# EAGLE design shield (EAGLE 7.6.0)
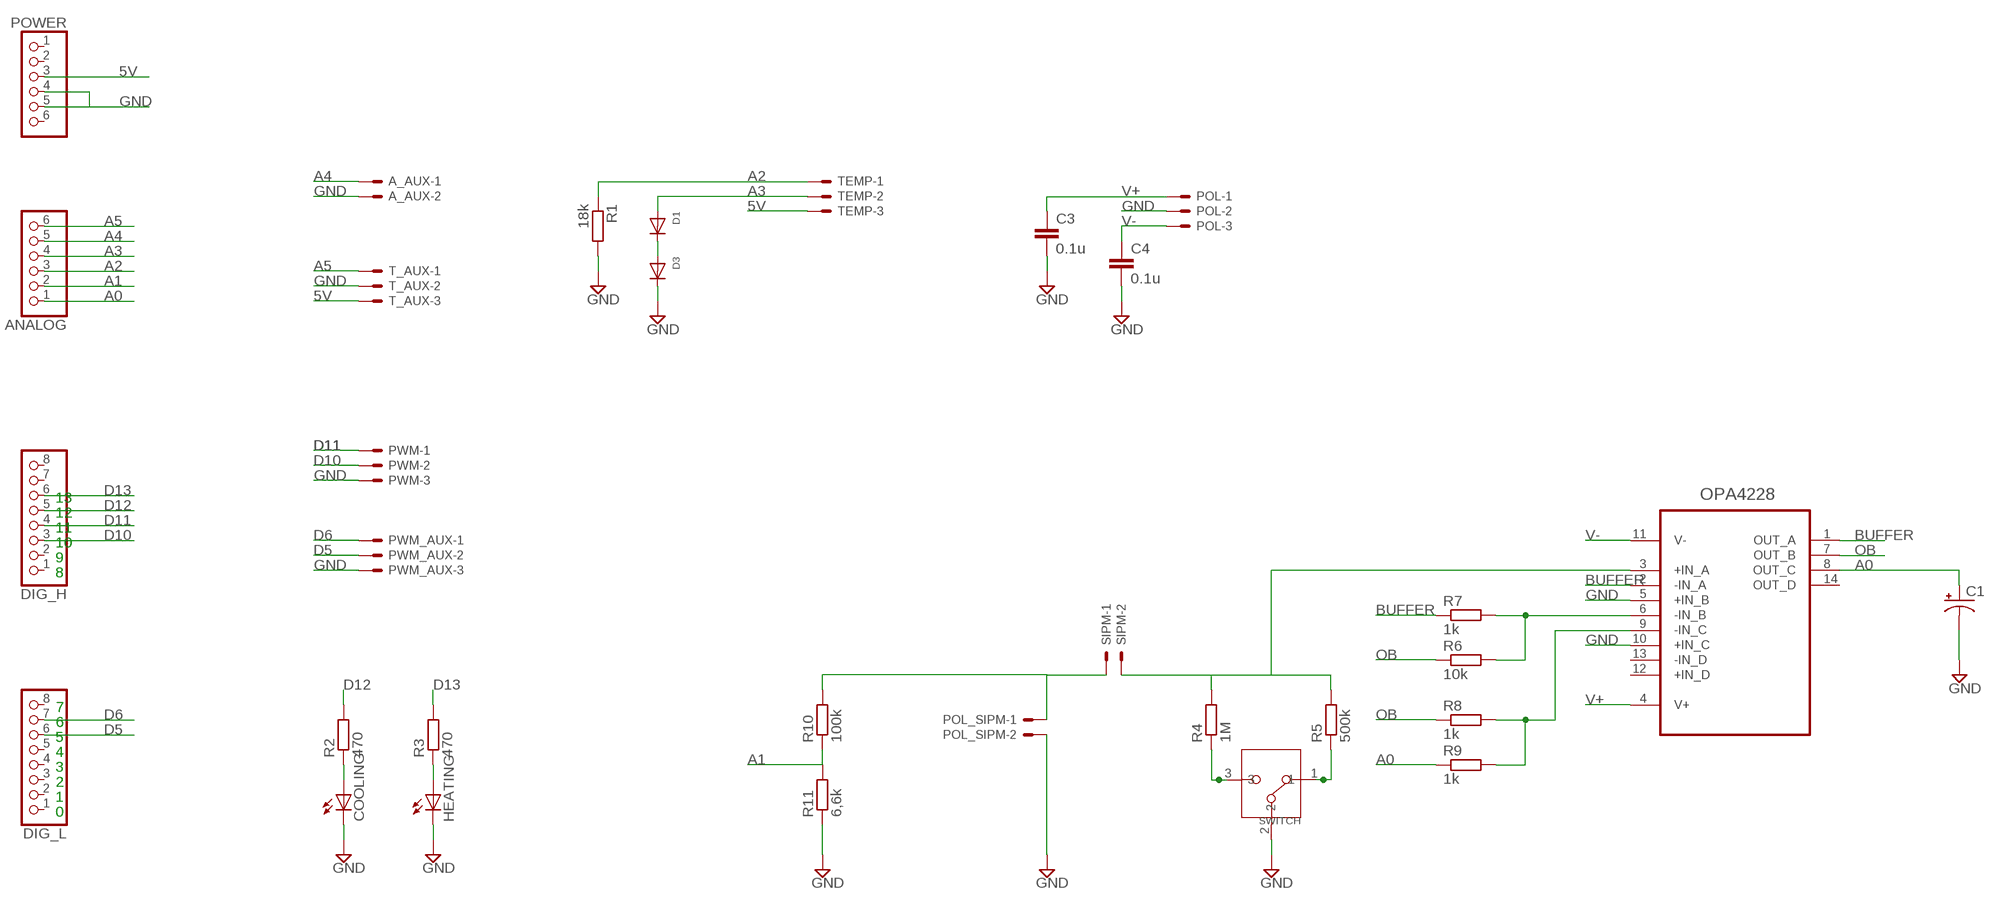
[diagram p0: schematic, sheet 1]

## Parts
A_AUX  22-23-2021  [22-23-2021]
ANALOG  PINHD-1X6  [1X06]
C1  CPOL-USSMCC  [SMC_C]
C3  0.1u  C-EUC0805K  [C0805K]
C4  0.1u  C-EUC0805K  [C0805K]
COOLING  LEDSMT1206  [1206]
D1  DIODEDO-1N4148  [DO-1N4148]
D3  DIODEDO-1N4148  [DO-1N4148]
DIG_H  PINHD-1X8  [1X08]
DIG_L  PINHD-1X8  [1X08]
HEATING  LEDSMT1206  [1206]
OPA4228  OPA4228UA  [SOIC127P600X175-14N]
POL  22-23-2031  [22-23-2031]
POL_SIPM  22-23-2021  [22-23-2021]
POWER  PINHD-1X6  [1X06]
PWM  22-23-2031  [22-23-2031]
PWM_AUX  22-23-2031  [22-23-2031]
R1  18k  R-EU_0309/12  [0309/12]
R2  470  R-EU_R0805W  [R0805W]
R3  470  R-EU_R0805W  [R0805W]
R4  1M  R-EU_R0805W  [R0805W]
R5  500k  R-EU_R0805W  [R0805W]
R6  10k  R-EU_R0805W  [R0805W]
R7  1k  R-EU_R0805W  [R0805W]
R8  1k  R-EU_R0805W  [R0805W]
R9  1k  R-EU_R0805W  [R0805W]
R10  100k  R-EU_R0805W  [R0805W]
R11  6,6k  R-EU_R0805W  [R0805W]
SIPM  22-23-2021  [22-23-2021]
SWITCH  DIP-SLIDE-SWITCH(3P-11.6X4.0X5.4+2.0MM)-EG1218  [SW3-2.5-11.6X4.0X5.4+2.0MM]
T_AUX  22-23-2031  [22-23-2031]
TEMP  22-23-2031  [22-23-2031]

## Nets
5V: POWER.3 T_AUX.3 TEMP.3
A0: ANALOG.1 C1.+ OPA4228.8(OUT_C) R9.1
A1: ANALOG.2 R10.1 R11.2
A2: ANALOG.3 R1.1 TEMP.1
A3: ANALOG.4 D1.A TEMP.2
A4: A_AUX.1 ANALOG.5
A5: ANALOG.6 T_AUX.1
BUFFER: OPA4228.1(OUT_A) OPA4228.2(-IN_A) R7.1
D5: DIG_L.6 PWM_AUX.2
D6: DIG_L.7 PWM_AUX.1
D10: DIG_H.3 PWM.2
D11: DIG_H.4 PWM.1
D12: DIG_H.5 R2.2
D13: DIG_H.6 R3.2
GND: A_AUX.2 C1.- C3.2 C4.2 COOLING.C D3.C HEATING.C OPA4228.5(+IN_B) OPA4228.10(+IN_C) POL.2 POL_SIPM.2 POWER.4 POWER.5 PWM.3 PWM_AUX.3 R1.2 R11.1 SWITCH.2 T_AUX.2
N$1: COOLING.A R2.1
N$2: HEATING.A R3.1
N$3: OPA4228.6(-IN_B) R6.2 R7.2
N$4: POL_SIPM.1 R10.2 SIPM.1
N$7: R4.1 SWITCH.3
N$8: R5.1 SWITCH.1
N$9: OPA4228.3(+IN_A) R4.2 R5.2 SIPM.2
N$12: OPA4228.9(-IN_C) R8.2 R9.2
N$16: D1.C D3.A
OB: OPA4228.7(OUT_B) R6.1 R8.1
V+: C3.1 OPA4228.4(V+) POL.1
V-: C4.1 OPA4228.11(V-) POL.3
Unconnected: DIG_H.1 DIG_H.2 DIG_H.7 DIG_H.8 DIG_L.1 DIG_L.2 DIG_L.3 DIG_L.4 DIG_L.5 DIG_L.8 OPA4228.12(+IN_D) OPA4228.13(-IN_D) OPA4228.14(OUT_D) POWER.1 POWER.2 POWER.6

## Notes on the sheet
- 13
- 12
- 11
- 10
- 9
- 8
- 7
- 6
- 5
- 4
- 3
- 2
- 1
- 0

## Library data of the parts
A_AUX POL_SIPM SIPM = con-molex:22-23-2021: .100" (2.54mm) Center Header - 2 Pin; MF: MOLEX; MPN: 22-23-2021; OC_FARNELL: 1462926; OC_NEWARK: 25C3832
ANALOG POWER = pinhead:PINHD-1X6: PIN HEADER
C1 = rcl:CPOL-US: POLARIZED CAPACITOR, American symbol
C3 C4 = resistor:C-EU: CAPACITOR, European symbol
COOLING HEATING = adafruit:LED: LED OSRAM: - CHIPLED LG R971, LG N971, LY N971, LG Q971, LY Q971, LO R971, LY R971 LH N974, LH R974 LS Q976, LO Q976, LY Q976 LO Q996 - Hyper CHIPLED LW Q18S LB Q993, LB Q99A, LB R99A - SideLED LS A670, LO A670, LY A670, LG A670, LP A670 LB A673, LV A673, LT A673, LW A673 LH A674 LY A675 LS A676, LA A676, LO A676, LY A676, LW A676 LS A679, LY A679, LG A679 - Hyper Micro SIDELED® LS Y876, LA Y876, LO Y876, LY Y876 LT Y87S - SmartLED LW L88C, LW L88S LB L89C, LB L89S, LG L890 LS L89K, LO L89K, LY L89K LS L896, LA L896, LO L896, LY L896 - TOPLED LS T670, LO T670, LY T670, LG T670, LP T670 LSG T670, LSP T670, LSY T670, LOP T670, LYG T670 LG T671, LOG T671, LSG T671 LB T673, LV T673, LT T673, LW T673 LH T674 LS T676, LA T676, LO T676, LY T676, LB T676, LH T676, LSB T676, LW T676 LB T67C, LV T67C, LT T67C, LS T67K, LO T67K, LY T67K, LW E67C LS E67B, LA E67B, LO E67B, LY E67B, LB E67C, LV E67C, LT E67C LW T67C LS T679, LY T679, LG T679 LS T770, LO T770, LY T770, LG T770, LP T770 LB T773, LV T773, LT T773, LW T773 LH T774 LS E675, LA E675, LY E675, LS T675 LS T776, LA T776, LO T776, LY T776, LB T776 LHGB T686 LT T68C, LB T68C - Hyper Mini TOPLED® LB M676 - Mini TOPLED Santana® LG M470 LS M47K, LO M47K, LY M47K Source: http://www.osram.convergy.de/
D1 D3 = adafruit:DIODE: Diode SMADIODE - SMA Surface Mount Package 20V 1A Schottky Diode Digikey: 641-1014-6-ND DO-1N4148 - Through Hole Small Current Diode SOD-123 20V 1 A (.5mV Vf) Schottky Diode - Digikey: MBRX120TPMSCT-ND SOD-323 10V 570mA (.38mV Vf, 3ns) Schottky Diode - Digikey: ZLLS410CT-ND SOD-523 30V 30mA Schottky Diode (RB751S-40TE61) - Digikey: RB751S-40TE61CT-ND SOT23-R/W - SOT23 Package (R = Solder Paste/Reflow Ovens, W = Hand-Soldering) BAT54Film 40V 300mA - Digikey: 497-7162-1-ND
DIG_H DIG_L = pinhead:PINHD-1X8: PIN HEADER
OPA4228 = OPA4228UA:OPA4228UA: OPERATIONAL AMPLIFIERS; DESCRIPTION: High Precision, Low Noise Operational Amplifiers 14-SOIC -55 to 125; DIGI-KEY_PART_NUMBER: OPA4228UA-ND; DIGI-KEY_PURCHASE_URL: https://www.digikey.com/product-detail/en/texas-instruments/OPA4228UA/OPA4228UA-ND/295581?utm_source=snapeda&utm_medium=aggregator&utm_campaign=symbol; MF: Texas Instruments; MP: OPA4228UA; PACKAGE: SOIC-14 Texas Instruments
POL PWM PWM_AUX T_AUX TEMP = con-molex:22-23-2031: .100" (2.54mm) Center Header - 3 Pin; MF: MOLEX; MPN: 22-23-2031; OC_FARNELL: 1462950; OC_NEWARK: 30C0862
R1 = rcl:R-EU_: RESISTOR, European symbol
R2-R11 = resistor:R-EU_: RESISTOR, European symbol
SWITCH = SWITCH_SPDT:DIP-SLIDE-SWITCH(3P-11.6X4.0X5.4+2.0MM): 311010006; AVAILABILITY: Good; DESCRIPTION: EG Series SPDT On-On Vertical Through Hole Slide Switch; MF: E-Switch; MP: EG1218; PACKAGE: FakePackage u; PRICE: 0.40 USD

## Net classes
0 default: width 0.152 mm, drill 0.305 mm, clearance 0.152 mm

## Board
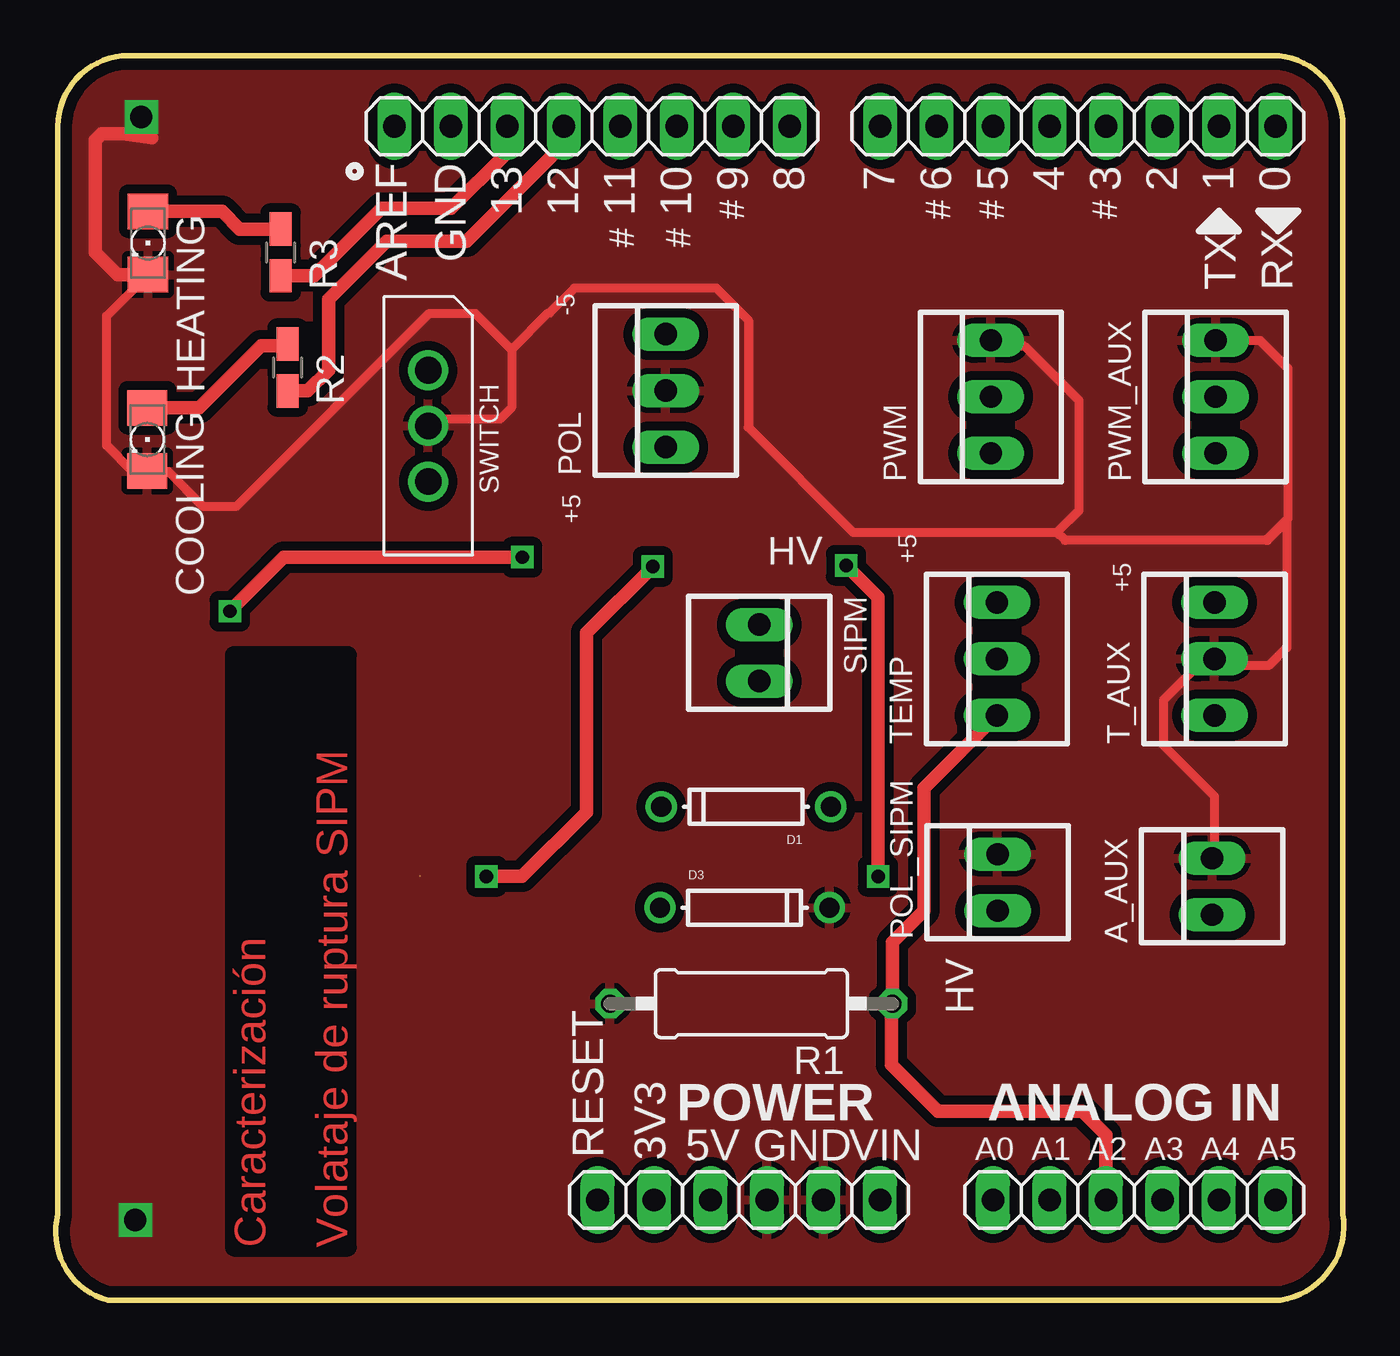
[diagram p1: board, top side]
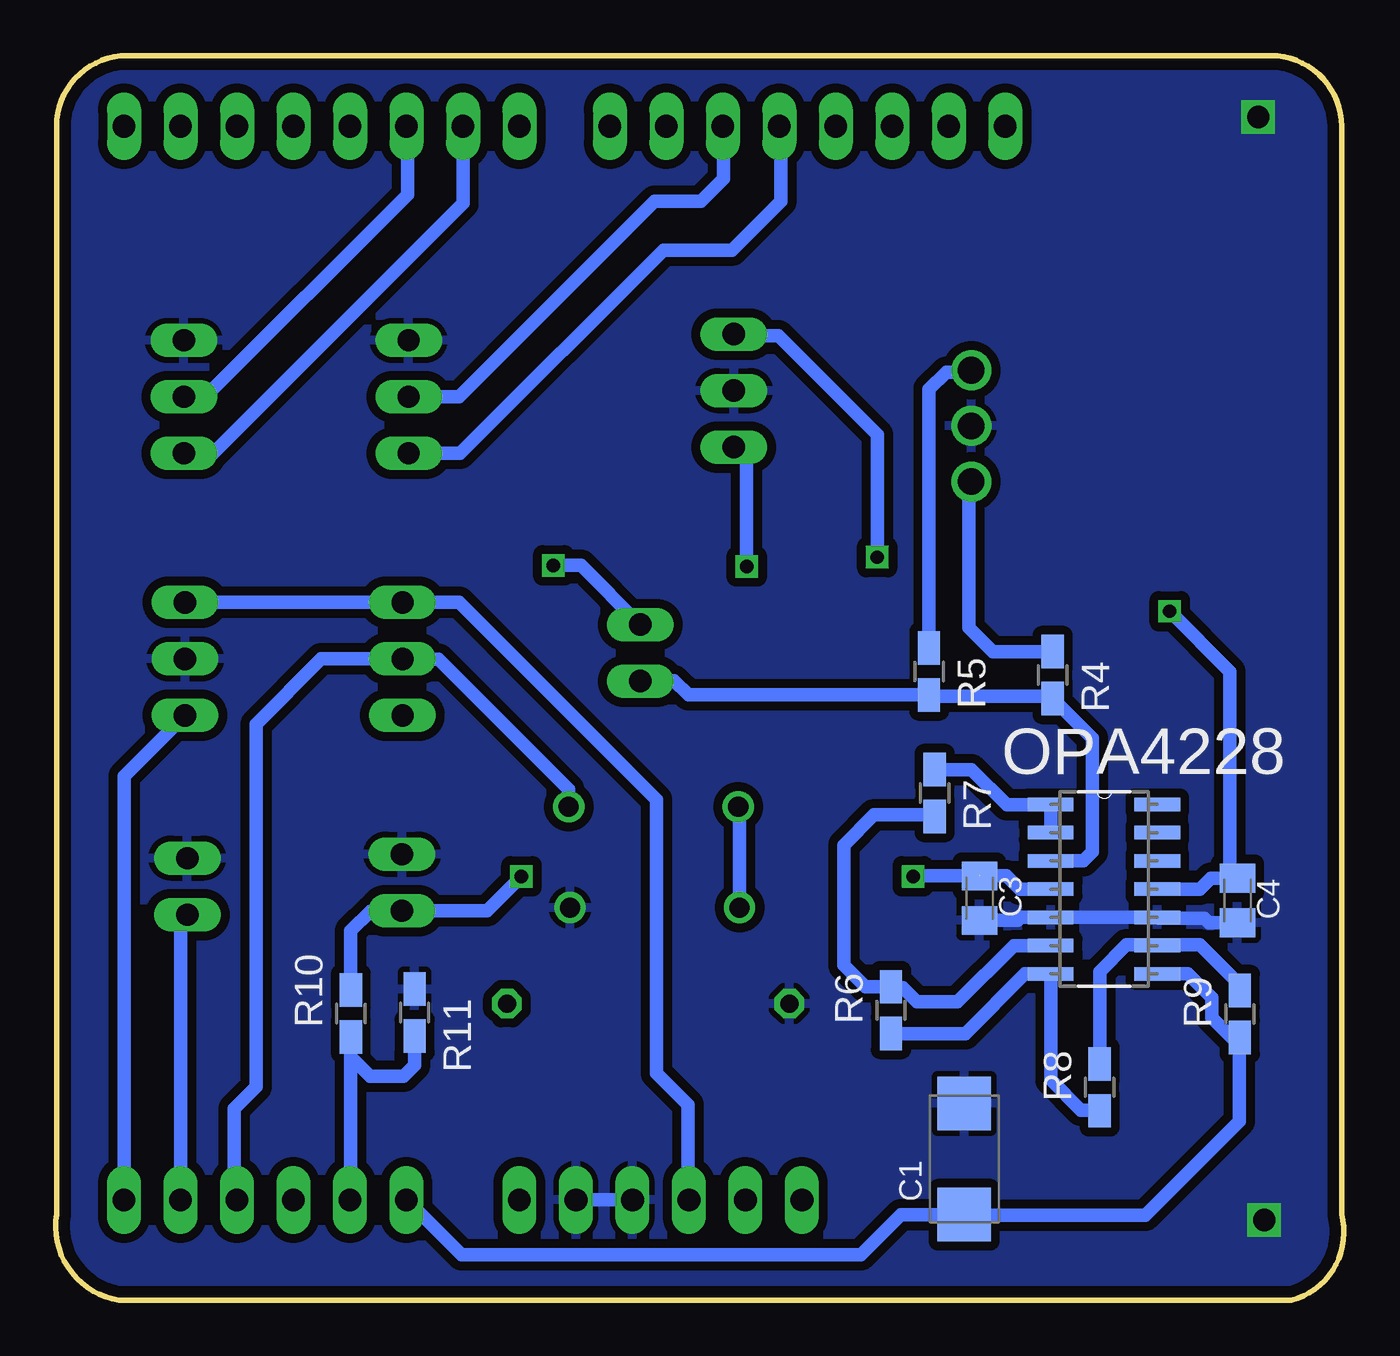
[diagram p2: board, bottom side, seen from below]

Size 57.93 x 55.95 mm. Coordinates in mm from the lower left corner, seen from the top.
Outline: 3.28,55.95 54.71,55.95 arc-90 57.89,52.77 57.89,3.88 arc-90 55.07,0 2.36,0 arc-90 0.1,3.88 0.1,52.77 arc-90 3.28,55.95
Copper layers (1*16): Top 0.035mm / dielectric 1.5mm / Bottom 0.035mm
Design rules "default *": minimum track width 10mil, minimum drill 24mil, track to track 16mil, track to pad 12mil, pad to pad 8mil, via to via 8mil, smd to smd 4mil, copper to edge 20mil, drill to drill 8mil, minimum pad ring 10mil, minimum via ring 8mil, stop-mask expansion 4mil, vias tented up to drill 0mil, thermal gap 10mil

### Footprints (pad centres in the part's own frame; a part is rotated, then mirrored left to right if it is on the bottom)
22-23-2021 = drill 1 long: 1 -1.27,0; 2 1.27,0
1X06 = drill 1.016 long: 1 -6.35,0; 2 -3.81,0; 3 -1.27,0; 4 1.27,0; 5 3.81,0; 6 6.35,0
SMC_C = smd 2.4 x 2.4: + -2.5,0; - 2.5,0
C0805K = smd 1.3 x 1.6: 1 -1,0; 2 1,0
1206 = smd 1.6 x 1.803: A -1.422,0; C 1.422,0
DO-1N4148 = drill 0.9: A -3.81,0; C 3.81,0
1X08 = drill 1.016 long: 1 -8.89,0; 2 -6.35,0; 3 -3.81,0; 4 -1.27,0; 5 1.27,0; 6 3.81,0; 7 6.35,0; 8 8.89,0
SOIC127P600X175-14N = smd 2.057 x 0.61: 1 -4.801,7.62; 2 -4.801,6.35; 3 -4.801,5.08; 4 -4.801,3.81; 5 -4.801,2.54; 6 -4.801,1.27; 7 -4.801,0; 8 0,0; 9 0,1.27; 10 0,2.54; 11 0,3.81; 12 0,5.08; 13 0,6.35; 14 0,7.62
22-23-2031 = drill 1 long: 1 -2.54,0; 2 0,0; 3 2.54,0
0309/12 = drill 0.813 octagon: 1 -6.35,0; 2 6.35,0
R0805W = smd 1.5 x 1: 1 -1.052,0; 2 1.052,0
SW3-2.5-11.6X4.0X5.4+2.0MM = drill 1.2: 1 -2.5,0; 2 0,0; 3 2.5,0

### Placement (x,y rotation side)
A_AUX  52,18.6 90 top
ANALOG  48.5,4.51 0 top
C1  17.07,6.36 90 bottom
C3  16.38,18.07 270 bottom
C4  4.78,17.97 270 bottom
COOLING  4.12,38.7 270 top
D1  31.04,22.18 180 top
D3  30.98,17.65 0 top
DIG_H  24.12,52.77 180 top
DIG_L  45.96,52.77 180 top
HEATING  4.15,47.52 270 top
OPA4228  8.38,14.68 0 bottom
POL  27.43,40.89 90 top
POL_SIPM  42.35,18.78 90 top
POWER  30.72,4.51 0 top
PWM  42.05,40.61 90 top
PWM_AUX  52.16,40.61 90 top
R1  31.28,13.34 180 top
R2  10.43,41.93 270 top
R3  10.12,47.1 270 top
R4  13.09,28.1 270 bottom
R5  18.65,28.26 270 bottom
R6  20.36,13.04 90 bottom
R7  18.4,22.8 270 bottom
R8  10.98,9.57 90 bottom
R9  4.68,12.88 90 bottom
R10  44.65,12.89 90 bottom
R11  41.78,12.94 270 bottom
SIPM  31.64,29.1 270 top
SWITCH  16.75,39.3 270 top
T_AUX  52.11,28.83 90 top
TEMP  42.33,28.83 90 top

### Tracks (layer width: path | path; a pad name or v marks a point on that pad's centre or on a via)
5V
  Bottom 0.61: T_AUX.3 TEMP.3 39.78,31.37 30.91,22.5 30.91,10.21 29.49,8.79 29.49,4.56 POWER.3
A0
  Bottom 0.61: R9.1 4.79,11.82 | OPA4228.8 7.01,14.68 5.93,13.6 5.93,12.7 5.06,11.82 4.79,11.82 | 4.79,11.82 4.7,11.73 4.7,8.05 8.93,3.83 17.04,3.83 C1.+ 19.91,3.85 21.72,2.04 39.68,2.04 ANALOG.1
A1
  Bottom 0.61: 44.65,11.88 R10.1 44.65,10.95 | ANALOG.2 44.65,4.51 44.65,10.95 | R11.2 41.78,10.57 42.28,10.07 43.78,10.07 44.65,10.95
A2
  Top 0.61: ANALOG.3 47.23,7.45 46.17,8.5 39.67,8.5 37.58,10.6 37.58,13.29 R1.1 37.63,16.09 39.05,17.5 39.05,23.01 TEMP.1
A3
  Bottom 0.61: ANALOG.4 49.9,4.65 49.9,8.61 48.9,9.61 48.9,25.9 45.98,28.83 TEMP.2 40.7,28.82 34.85,22.97 D1.A
A4
  Bottom 0.61: ANALOG.5 52.31,17.03 A_AUX.1
A5
  Bottom 0.61: ANALOG.6 54.85,23.55 T_AUX.1
BUFFER
  Bottom 0.61: OPA4228.2 OPA4228.1 13.21,22.27 15.16,22.27 16.75,23.86 R7.1
D5
  Bottom 0.61: PWM_AUX.2 51.19,40.61 42.1,49.7 42.1,52.73 DIG_L.6
D6
  Bottom 0.61: PWM_AUX.1 50.83,38.07 39.6,49.3 DIG_L.7
D10
  Bottom 0.61: PWM.2 39.79,40.61 31,49.41 28.9,49.41 27.9,50.41 27.9,52.75 DIG_H.3
D11
  Bottom 0.61: PWM.1 39.73,38.07 30.6,47.2 27.5,47.2 25.3,49.41 25.3,52.69 DIG_H.4
D12
  Top 0.61: R2.2 11.34,40.88 12.27,41.81 12.27,44.99 14.89,47.61 18.48,47.61 22.72,51.85 22.72,52.65 DIG_H.5
D13
  Top 0.61: R3.2 11.62,46.05 14.65,49.09 17.79,49.09 20.2,51.49 20.2,52.67 DIG_H.6
GND  (via drill 1, 1 pad 0.81)
  Top 0.406: 20.49,42.73 18.86,44.36 16.8,44.36 8.14,35.7 6.62,35.7 5.07,37.26 COOLING.C 3.45,37.27 2.29,38.42 2.29,44.24 HEATING.C | 20.49,42.73 20.49,40.11 19.98,39.6 17.05,39.6 SWITCH.2 | 20.49,42.73 22.14,44.38 22.21,44.38 23.32,45.49 29.71,45.49 31.15,44.05 31.15,39.23 35.86,34.52 45.03,34.52 | 45.03,34.52 46.02,35.52 46.02,40.43 43.57,42.88 42.32,42.88 PWM.3 | PWM_AUX.3 54.15,43.16 55.41,41.89 55.41,35.14 54.42,34.16 | 54.42,34.16 45.4,34.16 45.03,34.52 | 54.42,34.16 54.49,34.16 55.36,35.02 55.36,29.35 54.54,28.53 52.4,28.53 | 52.4,28.53 T_AUX.2 | 52.4,28.53 51.36,28.53 49.81,26.98 49.81,24.94 52.1,22.65 52.1,19.97 A_AUX.2
  Top 0.61: HEATING.C 2.79,46.1 1.78,47.1 1.78,52.13 2.08,52.43 3.04,52.43 4.32,52.25 4.01,53.32 4.05,53.28
  Bottom 0.61: C4.2 6.08,16.97 6.28,17.17 8.34,17.17 OPA4228.10 OPA4228.5 14.52,17.21 14.66,17.07 C3.2 | POWER.5 POWER.4
  other vias: 3.58,3.62 3.85,53.2
  pour Bottom: 2.56,-0.34 55,-0.34 arc90 57.83,3.83 57.83,52.99 arc90 54.92,55.91 3.5,55.91 arc90 0.17,52.57 0.17,3.96 arc90
  pour Top (isolate 0.406): 0.1,53 0.1,3.73 arc90 2.48,-0.23 55.59,-0.23 arc90 57.89,3.65 57.89,5.53 arc-90 57.87,5.54 57.87,52.43 arc90 54.31,55.99 3.17,55.99 arc90 0.11,52.93 0.11,52.81
N$1
  Top 0.61: COOLING.A 6.45,40.12 9.23,42.91 10.35,42.91 R2.1
N$2
  Top 0.61: HEATING.A 7.48,48.95 8.28,48.14 10.11,48.14 R3.1
N$3
  Bottom 0.61: OPA4228.6 14.84,15.95 17.37,13.42 19.19,13.42 19.83,14.05 20.32,14.05 R6.2 21.52,14.1 22.48,15.06 22.48,20.46 21.12,21.82 18.48,21.82 R7.2
N$4  (via drill 0.6)
  Top 0.61: v36.98,19.05 36.98,31.59 v35.54,33.03
  Bottom 0.61: R10.2 44.65,16.61 43.76,17.49 42.37,17.49 POL_SIPM.1 38.52,17.51 v36.98,19.05 | v35.54,33.03 34.3,33.03 SIPM.1
N$7
  Bottom 0.61: R4.1 15.79,29.16 16.86,30.23 16.86,36.7 SWITCH.3
N$8
  Bottom 0.61: R5.1 18.65,40.95 17.88,41.73 16.83,41.73 SWITCH.1
N$9
  Bottom 0.61: OPA4228.3 11.72,19.75 11.31,20.16 11.31,25.27 R4.2 13.19,27.15 18.59,27.15 R5.2 29.47,27.21 30.11,27.85 31.62,27.85 SIPM.2
N$12
  Bottom 0.61: R9.2 4.68,14.18 6.48,15.97 8.35,15.97 | 8.35,15.97 OPA4228.9 | R8.2 10.98,14.78 9.78,15.97 8.35,15.97
N$16
  Bottom 0.61: D3.A 27.17,22.12 D1.C
OB
  Bottom 0.61: R8.1 11.01,8.54 11.82,8.54 13.19,9.91 OPA4228.7 14.34,14.68 17.03,11.99 R6.1
V+  (via drill 0.6)  (1 unrouted)
  Top 0.61: v19.37,19.05 20.98,19.05 23.87,21.94 23.87,30 v26.85,32.98
  Bottom 0.61: OPA4228.4 14.57,18.48 15.17,19.08 C3.1 | C3.1 19.35,19.07 v19.37,19.05 | v26.85,32.98 26.85,37.77 POL.1
V-  (via drill 0.6)
  Top 0.61: v20.98,33.41 10.26,33.41 v7.83,30.97
  Bottom 0.61: OPA4228.11 6.48,18.47 5.98,18.97 C4.1 5.13,19.32 5.13,28.26 v7.83,30.96 v7.83,30.97 | v20.98,33.41 20.98,38.91 25.43,43.36 27.36,43.36 POL.3

### Text on the board
Top: Caracterización / Volataje de ruptura SIPM
tPlace: 13 | 12 | 11 | 10 | 9 | 8 | 7 | 6 | 5 | 4 | 3 | 2 | 1 | 0
tNames: AREF | GND | # | # | # | # | # | # | TX | RX | -5 | +5 | HV | +5 | +5 | HV | ANALOG IN | RESET | 3V3 | 5V | GND | VIN | A0 | A1 | A2 | A3 | A4 | A5
tDocu: Grupo Halley, UIS, Colombia
214bmp: D:/SmartProjects/Snc/a4_bn_logo2.bmp